# Altium schematic sheet Power_SwitchRegulators.SchDoc
size A2; SheetNumber: 3; SheetTotal: 14
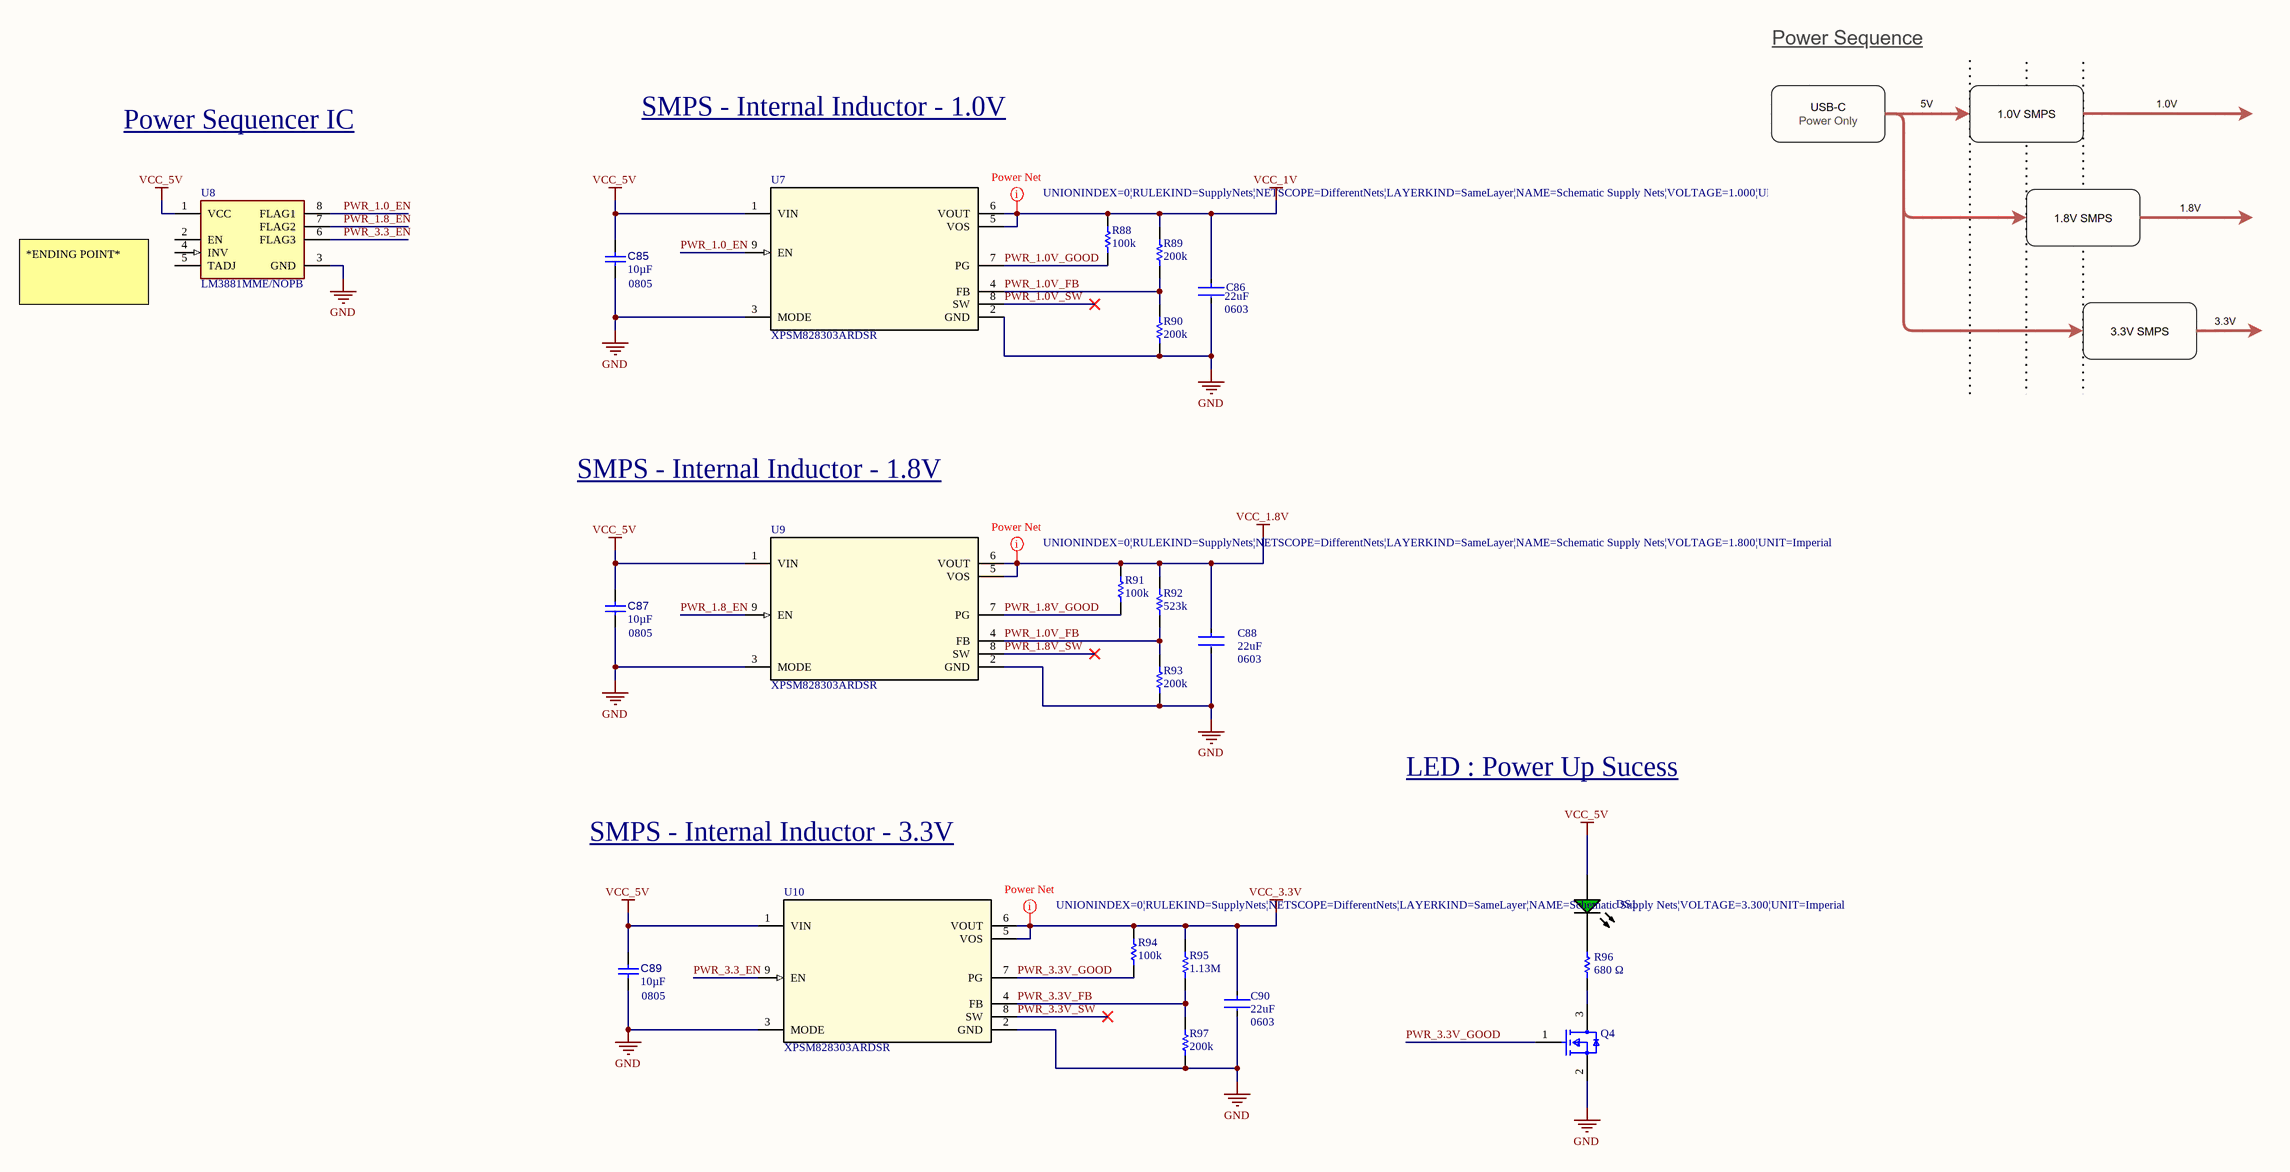
[diagram p0: Power_SwitchRegulators.SchDoc]

## Parts
C85  value 10µF  Case/Package: 0805  [CAPC0805(2012)145_L]  (hidden comment: Capacitor 10µF +/-20% 25V 0805)
C86  Capacitance: 22uF  Case/Package: 0603  [FP-GRM188-0_2-IPC_C]  (hidden comment: GRM188R60J226MEA0J)
C87  value 10µF  Case/Package: 0805  [CAPC0805(2012)145_L]  (hidden comment: Capacitor 10µF +/-20% 25V 0805)
C88  Capacitance: 22uF  Case/Package: 0603  [FP-GRM188-0_2-IPC_C]  (hidden comment: GRM188R60J226MEA0J)
C89  value 10µF  Case/Package: 0805  [CAPC0805(2012)145_L]  (hidden comment: Capacitor 10µF +/-20% 25V 0805)
C90  Capacitance: 22uF  Case/Package: 0603  [FP-GRM188-0_2-IPC_C]  (hidden comment: GRM188R60J226MEA0J)
DS1  HSMG-C170  [AVAG-HSMX-C170_V]  (value not drawn)
Q4  BSS138  [FP-318-08-IPC_B]  (value not drawn)
R88  value 100k  [RESC1005X40X25ML05T05]  (hidden comment: Resistor 100k +/-1% 0402 63 mW)
R89  value 200k  [RESC0402(1005)_L]  (hidden comment: Resistor 200K +/-1 % 0402 63 mW)
R90  value 200k  [RESC0402(1005)_L]  (hidden comment: Resistor 200K +/-1 % 0402 63 mW)
R91  value 100k  [RESC1005X40X25ML05T05]  (hidden comment: Resistor 100k +/-1% 0402 63 mW)
R92  value 523k  [RESC1005X40X25LL10T10]  (hidden comment: CR0402-FX-5233GLF)
R93  value 200k  [RESC0402(1005)_L]  (hidden comment: Resistor 200K +/-1 % 0402 63 mW)
R94  value 100k  [RESC1005X40X25ML05T05]  (hidden comment: Resistor 100k +/-1% 0402 63 mW)
R95  value 1.13M  [RESC1005X40X25NL05T05]  (hidden comment: CRCW04021M13FKED)
R96  Resistance: 680 Ω  [RESC1608X55X25ML10T15]  (hidden comment: RC0603JR-070RL)
R97  value 200k  [RESC0402(1005)_L]  (hidden comment: Resistor 200K +/-1 % 0402 63 mW)
U7  XPSM828303ARDSR  [RDS0009A-MFG]
U8  LM3881MME/NOPB  [FP-DGK0008A-IPC_B]
U9  XPSM828303ARDSR  [RDS0009A-MFG]
U10  XPSM828303ARDSR  [RDS0009A-MFG]

## Nets
GND: C85.1 C86.2 C87.1 C88.2 C89.1 C90.2 Q4.2(S) R90.1 R93.1 R97.1 U7.2(GND) U7.3(MODE) U8.3(GND) U9.2(GND) U9.3(MODE) U10.2(GND) U10.3(MODE)
VCC_1.8V: C88.1 R91.2 R92.1 U9.5(VOS) U9.6(VOUT)
VCC_1V: C86.1 R88.2 R89.2 U7.5(VOS) U7.6(VOUT)
VCC_3.3V: C90.1 R94.2 R95.2 U10.5(VOS) U10.6(VOUT)
VCC_5V: C85.2 C87.2 C89.2 DS1.1(A) U7.1(VIN) U8.1(VCC) U9.1(VIN) U10.1(VIN)
PWR_1.0_EN: U7.9(EN) U8.8(FLAG1)
PWR_1.0V_FB: R89.1 R90.2 R92.2 R93.2 U7.4(FB) U9.4(FB)
PWR_1.0V_GOOD: R88.1 U7.7(PG)
PWR_1.0V_SW: U7.8(SW)
PWR_1.8_EN: U8.7(FLAG2) U9.9(EN)
PWR_1.8V_GOOD: R91.1 U9.7(PG)
PWR_1.8V_SW: U9.8(SW)
PWR_3.3_EN: U8.6(FLAG3) U10.9(EN)
PWR_3.3V_FB: R95.1 R97.2 U10.4(FB)
PWR_3.3V_GOOD: Q4.1(G) R94.1 U10.7(PG)
PWR_3.3V_SW: U10.8(SW)
NetDS1_2: DS1.2(K) R96.1
NetQ4_3: Q4.3(D) R96.2

Not connected (* = marked no-connect by the designer): U8 2(EN) 4(INV) 5(TADJ)

## Layout directives
rule Supply Nets [Voltage = 1.000]: VCC_1V
rule Supply Nets [Voltage = 1.800]: VCC_1.8V
rule Supply Nets [Voltage = 3.300]: VCC_3.3V

## Notes on the sheet
- Power Sequencer IC
- SMPS - Internal Inductor - 1.0V
- *ENDING POINT*
- SMPS - Internal Inductor - 1.8V
- LED : Power Up Sucess
- SMPS - Internal Inductor - 3.3V

## Library data of the parts
C85 C87 C89 = CMP-001-00079-5: Chip Capacitor, 10µF +/-20%, 25V, 0805, Thickness 1.45 mm; Tolerance: 10%; Pins: 2; Voltage Rating: 25V; Mounting Technology: SMT; Min Operating Temperature: -55°C; Max Operating Temperature: 85°C
C86 C88 C90 = CMP-06035-027361-1: Chip Multilayer Ceramic Capacitors for General Purpose, 0603, 22uF, X5R, 15%, 20%, 6.3V; Case Code (Metric): 1608; Thickness: 0.039inch; Dielectric: X5R; Voltage Rating: 6.3V; Termination: SMD/SMT; Voltage Rating (DC): 6.3V; Width: 0.031inch; Weight: 0.000222oz; Tolerance: 20%; Lead Free: Lead Free; Package Quantity: 10000; Case Code (Imperial): 0603; Length: 0.063inch; Packaging: Tape and Reel; Max Operating Temperature: 85°C; Min Operating Temperature: -55°C; Mount: Surface Mount
DS1 = CMP-2000-05062-1: Chip LED, Green, 2.2 V, -40 to 85 degC, 2-Pin SMD, Pb-Free, Tape and Reel; Manufacturer: Avago; No. of Pins: 2; Peak Wavelength: 570nm; SVHC: NoSVHC(16-Jun-2014); Dominant Wavelength: 572nm; Forward Current If: 20mA; Viewing Angle: 170deg; Lens Shape: Rectangular; PIV Max: 5V; External Width: 1.25mm; LED Type: Standard; External Depth: 0.8mm; Opto Mounting Orientation: Top; Luminous Intensity: 15mcd; Luminous Intensity Min: 4mcd; Forward Voltage VF Max: 2.6V; External Length / Height: 2mm; Bulb Size: 1.25mmx1.4mm; Light Area Height: 1mm; Voltage Vf Typ: 2.2V; Operating Temperature Max: 85degC; Datasheet Version: Oct-08; MSL: MSL2A-4weeks; Peak Forward Current: 20mA; Package Description: 2-Pin Surface Mount Device, Body 2 x 1.25 mm, Height 0.8 mm; Datasheet URL: https://datasheet.ciiva.com/29280/180495-da-01-en-chip-led-hsmg-c170-gelb-gruen-29280971.pdf; Storage Temperature Min: -40degC; LED Colour: Green; Wavelength Typ: 570nm; Mounting Type: SMD; Forward Current If Max: 20mA; Dominant Wavelength Typ: 572nm; LED Mounting: SMD; Operating Temperature Range: -30degCto+85degC; Operating Temperature Min: -30degC; Manufacturer URL: http://www.avagotech.com/; Packaging: CutTape; Luminous Intensity Typ: 15mcd; Package Reference: HSMX-C170; Storage Temperature Max: 85degC; Opto Case Style: SMD; Forward Voltage: 2.2V
Q4 = CMP-07173-000101-1: MOSFET N-CH 50V 220MA SOT-23; Turn-Off Delay Time: 20ns; Element Configuration: Single; Rds On Max: 3.5R; Gate to Source Voltage (Vgs): 20V; Threshold Voltage: 1.3V; Number of Elements: 1; Power Dissipation: 360mW; Rise Time: 9ns; Turn-On Delay Time: 2.5ns; Input Capacitance: 27pF; On-State Resistance: 6R; Lead Free: Lead Free; Length: 2.92mm; Width: 1.3mm; Drain to Source Breakdown Voltage: 50V; Min Operating Temperature: -55°C; REACH SVHC: No SVHC; Packaging: Tape and Reel; Radiation Hardening: No; Height: 0.93mm; Drain to Source Voltage (Vdss): 50V; Current Rating: 220mA; Voltage Rating (DC): 50V; Weight: 0.03g; Continuous Drain Current (ID): 220mA; Number of Pins: 3; Nominal Vgs: 1.3V; Max Power Dissipation: 360mW; Fall Time: 9ns; Drain to Source Resistance: 3.5R; Contact Plating: Tin; Case/Package: SOT-23; Package Quantity: 1; Dual Supply Voltage: 50V; Mount: Surface Mount; Termination: SMD/SMT; Max Operating Temperature: 150°C
R88 R91 R94 = CMP-009-00021-6: Chip Resistor, 100 KOhm, +/- 1%, 0.063 W, -55 to 155 degC, 0402 (1005 Metric); Power: 63mW; Voltage Rating: 50V; Case/Package: 0402; RoHS Compliant: True; Max Operating Temperature: 155°C; Mounting Technology: SM; Tolerance: 1%; Min Operating Temperature: -55°C; Pins: 2
R89 R90 R93 R97 = CMP-009-00163-4: Chip Resistor, 200 kOhms, +/-1 %, 63 mW, -55 to 155 degC, 0402; Tolerance: 1%; Power: 63mW; Min Operating Temperature: -55°C; Pins: 2; Max Operating Temperature: 155°C; Case/Package: 0402
R92 = CMP-009-00203-1: Res Thick Film 0402 523K Ohm 1% 1/16W 100ppm/C Molded SMD SMD Paper Tape on Plastic Reel; Voltage Rating: 50V; Max Operating Temperature: 155°C; Case/Package: 0402; Mounting Technology: Surface Mount; Tolerance: 1%; Min Operating Temperature: -55°C
R95 = CMP-009-00207-1: Res Thick Film 0402 1.13M Ohm 1% 0.063W(1/16W) ±100ppm/C Pad SMD T/R Automotive; Voltage Rating: 50V; Max Operating Temperature: 155°C; Pins: 2; Mounting Technology: Surface Mount; Case/Package: 0402; Tolerance: 1%; Min Operating Temperature: -55°C
R96 = CMP-2100-03667-1: Chip Resistor, 0 Ohm, +/- 5%, 0.1 W, -55 to 155 degC, 0603 (1608 Metric), RoHS, Tape and Reel; Manufacturer: Yageo; Temperature Coefficient: 200ppm/degreesC; Voltage Rating: 50V; Power Rating: 100mW; Width: 0.8mm; Max Operating Temperature: 155degC; Tolerance: 5%; Package Reference: 0603; Height: 0.45mm; Depth: 0.8mm; Package Description: 2-Pin Surface Mount Device, Body 1.6 x 0.8 mm; Termination: SMD/SMT; Package Quantity: 5000; Case/Package: 0603; Case Code (Imperial): 0603; Radiation Hardening: No; Number of Pins: 2; Length: 1.6mm; Lead Free: LeadFree; Voltage Rating (DC): 50V; Military Standard: Not; Datasheet URL: http://www.yageo.com/NewPortal/yageodocoutput?fileName=/pdf/R-Chip/PYu-RC_Group_51_RoHS_L_5.pdf; Manufacturer URL: http://www.yageo.com/; Packaging: TapeandReel; Case Code (Metric): 1608; Min Operating Temperature: -55degC; Composition: ThickFilm; RoHSCompliant: true; Contact Plating: Tin; Datasheet Version: Rev. 5, 10/2016; REACH SVHC: NoSVHC
U7 U9 U10 = CMP-006-00049-1: 2.25-V to 5.5-V, 3-A, low-noise step-down module with integrated inductor in QFN package 9-QFN-FCMOD -40 to 125; Manufacturer_Name: Texas Instruments; Datasheet: https://www.ti.com/lit/gpn/tpsm828303; TYPE: TYPE; Copyright: Copyright (C) 2025 Ultra Librarian. All rights reserved.; Source: XPSM828303ARDSR.SchLib; Manufacturer_Part_Number: XPSM828303ARDSR; Design Item ID: XPSM828303ARDSR; RefDes: RefDes; ComponentLink1Description: New link; ComponentLink1URL: *
U8 = CMP-019-00053-1: 3 rail simple power sequencer with adjustable time delay 8-VSSOP -40 to 125; Nominal Supply Current: 80µA; Output Current: 1nA; Min Supply Voltage: 2.7V; Max Supply Voltage: 5.5V; Min Operating Temperature: -40°C; Pins: 8; Mounting Technology: Surface Mount; Case/Package: VSSOP; Max Operating Temperature: 125°C